# Altium schematic sheet Power_Amplifier.SchDoc
size A4; DocumentNumber: 4; SheetNumber: 4; SheetTotal: 6
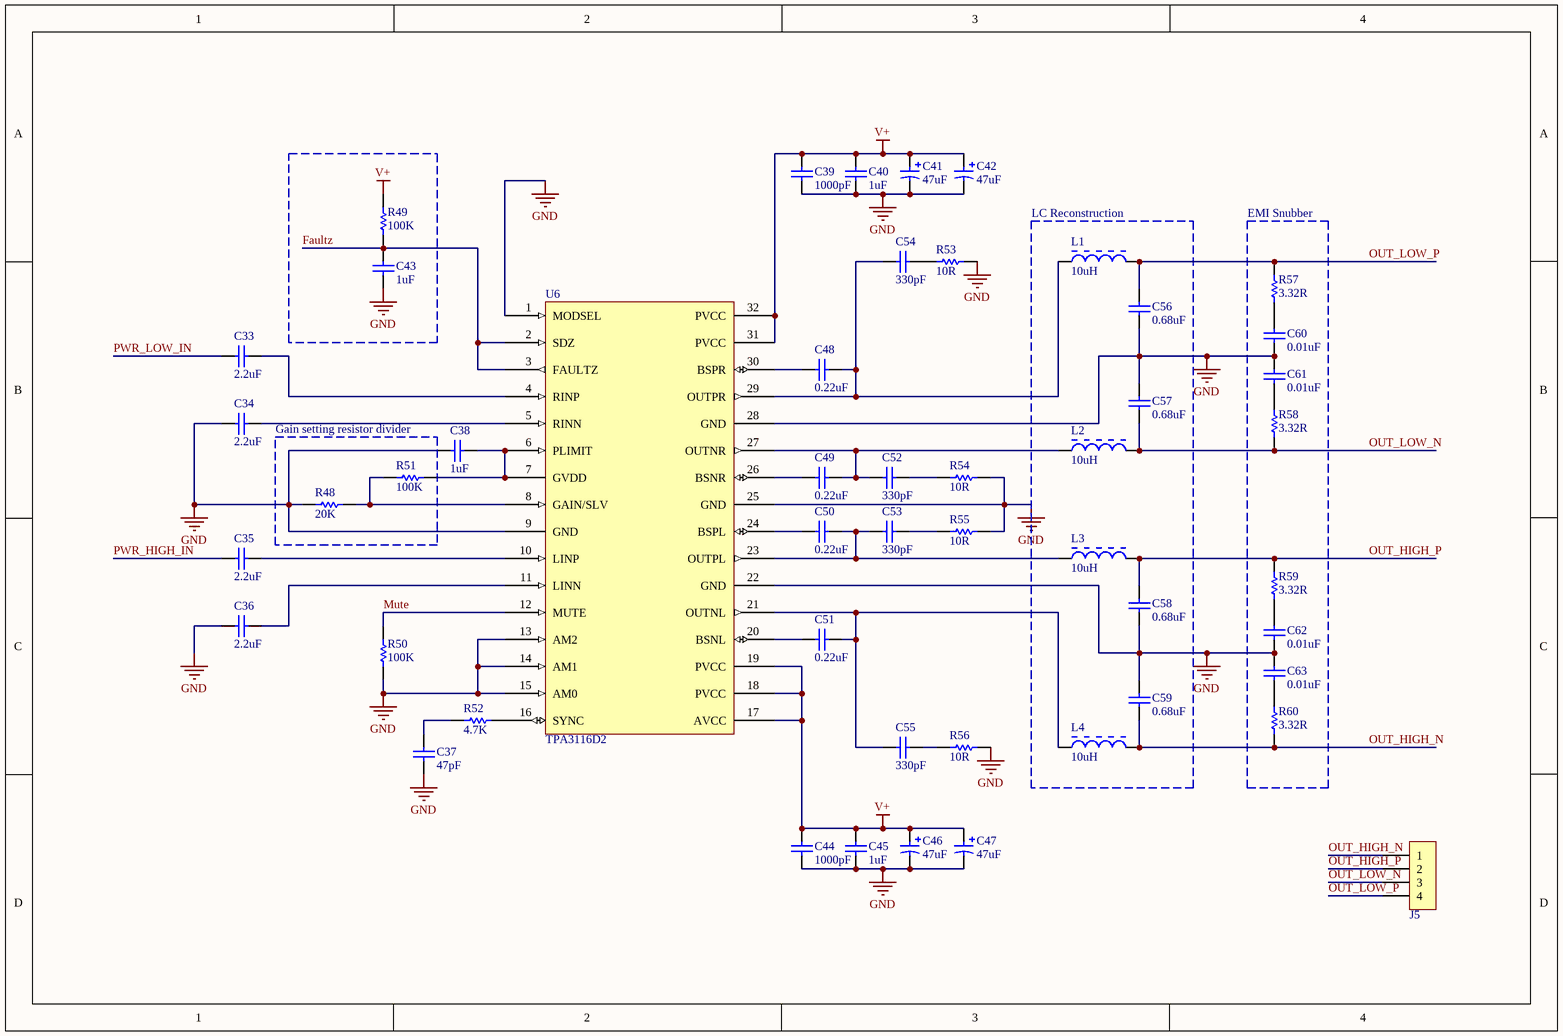
[diagram p0: Power_Amplifier.SchDoc]

## Parts
C33  2.2uF  [CAP Radial 7.5MM]
C34  2.2uF  [CAP Radial 7.5MM]
C35  2.2uF  [CAP Radial 7.5MM]
C36  2.2uF  [CAP Radial 7.5MM]
C37  47pF  [CAPC1608X09N]
C38  1uF  [CAPC1608X09N]
C39  1000pF  [CAPC1608X09N]
C40  1uF  [CAPC1608X09N]
C41  47uF  [CAP_EEFK_D]
C42  47uF  [CAP_EEFK_D]
C43  1uF  [CAPC1608X09N]
C44  1000pF  [CAPC1608X09N]
C45  1uF  [CAPC1608X09N]
C46  47uF  [CAP_EEFK_D]
C47  47uF  [CAP_EEFK_D]
C48  0.22uF  [CAPC1608X09N]
C49  0.22uF  [CAPC1608X09N]
C50  0.22uF  [CAPC1608X09N]
C51  0.22uF  [CAPC1608X09N]
C52  330pF  [CAPC1608X09N]
C53  330pF  [CAPC1608X09N]
C54  330pF  [CAPC1608X09N]
C55  330pF  [CAPC1608X09N]
C56  0.68uF  [CAP Radial 5mm]
C57  0.68uF  [CAP Radial 5mm]
C58  0.68uF  [CAP Radial 5mm]
C59  0.68uF  [CAP Radial 5mm]
C60  0.01uF  [CAPC1608X09N]
C61  0.01uF  [CAPC1608X09N]
C62  0.01uF  [CAPC1608X09N]
C63  0.01uF  [CAPC1608X09N]
J5  TERMINAL BLOCK 4POS  [TERMINAL BLOCK 5MM 4POS]  (value not drawn)
L1  10uH  [IND_BOURNS_SRN10]
L2  10uH  [IND_BOURNS_SRN10]
L3  10uH  [IND_BOURNS_SRN10]
L4  10uH  [IND_BOURNS_SRN10]
R48  20K  [RESC1608X06N]
R49  100K  [RESC1608X06N]
R50  100K  [RESC1608X06N]
R51  100K  [RESC1608X06N]
R52  4.7K  [RESC1608X06N]
R53  10R  [RESC1608X06N]
R54  10R  [RESC1608X06N]
R55  10R  [RESC1608X06N]
R56  10R  [RESC1608X06N]
R57  3.32R  [RESC1608X06N]
R58  3.32R  [RESC1608X06N]
R59  3.32R  [RESC1608X06N]
R60  3.32R  [RESC1608X06N]
U6  TPA3116D2  [DAP0032A]

## Blocks framed on the sheet
LC Reconstruction: C56-C59 L1-L4
EMI Snubber: C60-C63 R57-R60
Gain setting resistor divider: R48 R51

## Nets
GND: C34.1 C36.1 C37.1 C38.2 C39.1 C40.1 C41.2 C42.2 C43.1 C44.1 C45.1 C46.2 C47.2 C56.1 C57.2 C58.1 C59.2 C60.1 C61.2 C62.1 C63.2 R48.1 R50.1 R53.2 R54.2 R55.2 R56.2 U6.1(MODSEL) U6.9(GND) U6.13(AM2) U6.14(AM1) U6.15(AM0) U6.22(GND) U6.25(GND) U6.28(GND) U6.33(POWERPAD)
V+: C39.2 C40.2 C41.1 C42.1 C44.2 C45.2 C46.1 C47.1 R49.2 U6.17(AVCC) U6.18(PVCC) U6.19(PVCC) U6.31(PVCC) U6.32(PVCC)
Faultz: C43.2 R49.1 U6.2(SDZ) U6.3(FAULTZ)
Mute: R50.2 U6.12(MUTE)
OUT_HIGH_N: C59.1 J5.1 L4.2 R60.1
OUT_HIGH_P: C58.2 J5.2 L3.2 R59.2
OUT_LOW_N: C57.1 J5.3 L2.2 R58.1
OUT_LOW_P: C56.2 J5.4 L1.2 R57.2
PWR_HIGH_IN: C35.1
PWR_LOW_IN: C33.1
NetC33_2: C33.2 U6.4(RINP)
NetC34_2: C34.2 U6.5(RINN)
NetC35_2: C35.2 U6.10(LINP)
NetC36_2: C36.2 U6.11(LINN)
NetC37_2: C37.2 R52.1
NetC38_1: C38.1 R51.2 U6.6(PLIMIT) U6.7(GVDD)
NetC48_1: C48.1 U6.30(BSPR)
NetC48_2: C48.2 C54.1 L1.1 U6.29(OUTPR)
NetC49_1: C49.1 U6.26(BSNR)
NetC49_2: C49.2 C52.1 L2.1 U6.27(OUTNR)
NetC50_1: C50.1 U6.24(BSPL)
NetC50_2: C50.2 C53.1 L3.1 U6.23(OUTPL)
NetC51_1: C51.1 U6.20(BSNL)
NetC51_2: C51.2 C55.1 L4.1 U6.21(OUTNL)
NetC52_2: C52.2 R54.1
NetC53_2: C53.2 R55.1
NetC54_2: C54.2 R53.1
NetC55_2: C55.2 R56.1
NetC60_2: C60.2 R57.1
NetC61_1: C61.1 R58.2
NetC62_2: C62.2 R59.1
NetC63_1: C63.1 R60.2
NetR48_2: R48.2 R51.1 U6.8(GAIN/SLV)
NetR52_2: R52.2 U6.16(SYNC)

## Library data of the parts
C33-C36 = CAP FILM 2.2uF RADIAL 7.5MM: Audio coupling cap; Manufacturer: EPCOS (TDK); Manufacturer P/N: B32520C225K; Voltage: 40V; Value: 2.2uF; Digikey Part Number: 495-4814-ND
C37 = CAP CER 47pF 0603: Rating: C0G; Voltage: 50V; Value: 47pF; Digikey Part Number: 490-1419-1-ND
C38 C40 C43 C45 = CAP CER 1uF 0603: Manufacturer: Murata; Manufacturer Part Number: GRM188R7YA105KA12D; Voltage: 35V; Rating: X7R; Tolerance: 10%; Value: 1uF; Digikey Part Number: 490-10487-1-ND
C39 C44 = CAP CER 1000pF 0603: Manufacturer: Murata; Rating: C0G; Voltage: 50V; Value: 1000pF; Digikey Part Number: 490-1451-1-ND
C41 C42 C46 C47 = CAP ALUM 47uF SMD: Manufacturer: Panasonic; Voltage: 35V; Digikey Part Number: PCE3842CT-ND; Value: 47uF
C48-C51 = CAP CER 0.22uF 0603: Manufacturer: Murata; Voltage: 50V; Rating: X7R; Value: 0.22uF; Digikey Part Number: 1276-1111-1-ND
C52-C55 = CAP CER 330pF 0603: Manufacturer: Murata; Rating: C0G; Voltage: 50V; Value: 330pF; Digikey Part Number: 490-1439-1-ND
C56-C59 = CAP 0.68uF Radial 5mm: Output Cap; Manufacturer: EPCOS (TDK); Voltage: 63V; Value: 0.68uF; Digikey Part Number: 495-1114-ND
C60-C63 = CAP CER 0.01uF 0603: Manufacturer: Murata; Rating: C0G; Value: 0.01uF; Digikey Part Number: 490-9666-1-ND
L1-L4 = IND 10uH 5A SMD: Digikey Part Number: SRN1060-100MCT-ND; Value: 10uH
R48 = RES 20K 0603: Tolerance: 1%; Power: 0.1W; Footprint: 0603; Value: 20K; Digikey Part Number: 311-20.0KHRCT-ND
R49-R51 = RES 100K 0603: Tolerance: 1%; Power: 0.1W; Footprint: 0603; Value: 100K; Digikey Part Number: 311-100KHRCT-ND
R52 = RES 4.7K 0603: Tolerance: 1%; Type: RES; Footprint: 0603; Value: 4.7K; Digikey Part Number: 311-4.70KHRCT-ND
R53-R56 = RES 10R 0603: Tolerance: 1%; Power: 0.25W; Type: RES; Footprint: 0603; Digikey Part Number: RHM10.0ADCT-ND; Value: 10R
R57-R60 = RES 3.32R 0603: Tolerance: 1%; Power: 0.1W; Type: RES; Footprint: 0603; Digikey Part Number: 311-3.32HRCT-ND; Value: 3.32R
J5 = TERMINAL BLOCK 4POS: Digikey Part Number: ED2563-ND
U6 = TPA3116D2: Digikey Part Number: 296-39337-1-ND